# Altium project DB30.PRJPCB
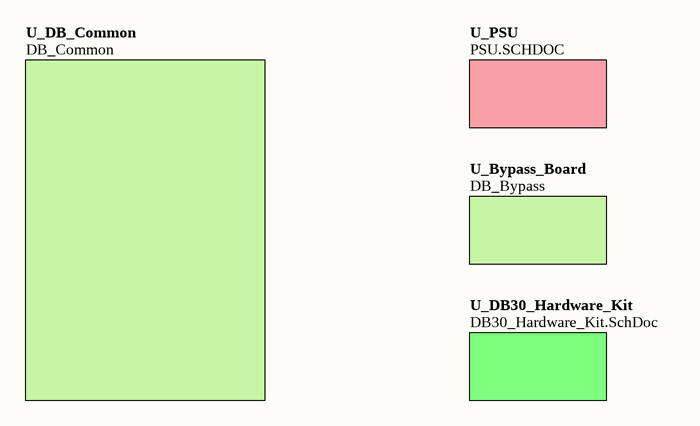
[diagram p0: DB30_Top.SchDoc]
ProjectAddress1: L3, 12A Rodborough Road; ProjectAddress2: Frenchs Forest; ProjectAddress3: NSW 2086; ProjectAddress4: Australia; ProjectAssyNum: D-820-0004; ProjectOrganization: Altium Limited; ProjectRevision: 07; ProjectTitle: DB30 - Daughter Board Spartan3; ProjectTotalSheets: 22
6 sheets, 49 parts. Net scope: hierarchical (ports join the sheet entries above them; power ports are global).
Board files: DB30_Panel.PcbDoc, DB30.PcbDoc
Sheets:
  DB30_Top.SchDoc
    U_PSU = PSU.SCHDOC
    U_DB30_Hardware_Kit = DB30_Hardware_Kit.SchDoc
  DEVICES.SchDoc
  Bypass_FPGA_1V2.SchDoc
  Bypass_FPGA_2V5.SchDoc

## Sheet DB30_Top.SchDoc: DB30 Top Level
size A4; Address1: Level 3, 12a Rodborough Rd; Address2: Frenchs Forest 2086; Address3: NSW; Address4: AUSTRALIA; SheetNumber: 2; SheetTotal: 23

### Sub-sheets
U_Bypass_Board = DB_Bypass (file not in this document): no entries
U_DB30_Hardware_Kit = DB30_Hardware_Kit.SchDoc: no entries
U_DB_Common = DB_Common (file not in this document): no entries
U_PSU = PSU.SCHDOC: no entries

### Notes on the sheet
- Sheet Title
- Project Title
- Size:
- Date:
- A4
- Assy:
- Time:
- Revision:
- Sheet
- of
- File:

## Sheet PSU.SCHDOC: Power Supply Top Level
size A4; Address1: Level 3, 12a Rodborough Rd; Address2: Frenchs Forest 2086; Address3: NSW; Address4: AUSTRALIA; SheetNumber: 10; SheetTotal: 23
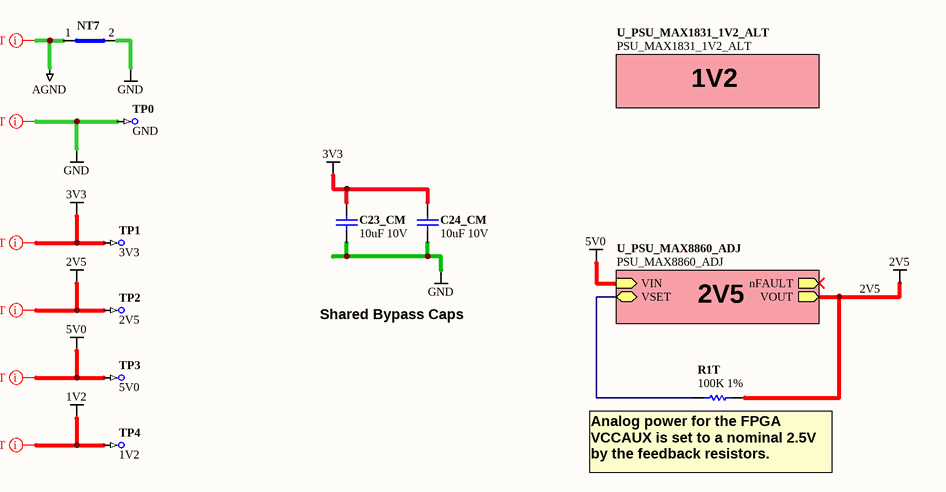
[diagram p1: PSU.SCHDOC]

### Parts
C23_CM  10uF 10V  [CAPC2012-STAR]
C24_CM  10uF 10V  [CAPC2012-STAR]
NT7  Net Tie SMT2  [NETTIE-SMT2-8X8]  (value not drawn)  (net tie, no BOM)
R1T  100K 1%  [RESC1005-STAR]
TP0  GND  [TestPin]  (no BOM)
TP1  3V3  [TestPin]  (no BOM)
TP2  2V5  [TestPin]  (no BOM)
TP3  5V0  [TestPin]  (no BOM)
TP4  1V2  [TestPin]  (no BOM)

### Sub-sheets
U_PSU_MAX1831_1V2_ALT = PSU_MAX1831_1V2_ALT (file not in this document): no entries
U_PSU_MAX8860_ADJ = PSU_MAX8860_ADJ (file not in this document): nFAULT (out), VIN (in), VOUT (out), VSET (bidir)

### Nets
1V2: TP4.1
2V5: R1T.2 TP2.1 ; sheet U_PSU_MAX8860_ADJ/VOUT
3V3: C23_CM.1 C24_CM.1 TP1.1
5V0: TP3.1 ; sheet U_PSU_MAX8860_ADJ/VIN
AGND: NT7.1(Net1)
GND: C23_CM.2 C24_CM.2 NT7.2(Net2) TP0.1
NetR1T_1: R1T.1 ; sheet U_PSU_MAX8860_ADJ/VSET

### Layout directives
net class PWRNET: 1V2, 2V5, 3V3, 5V0, AGND, GND

### Notes on the sheet
- 1V2
- Shared Bypass Caps
- 2V5
- (near R1T) Analog power for the FPGA VCCAUX is set to a nominal 2.5V by the feedback resistors.
- Sheet Title
- Project Title
- Size:
- Date:
- A4
- Assy:
- Time:
- Revision:
- Sheet
- of
- File:

### Library data of the parts
C23_CM C24_CM = D-101-0087: Capacitor, Ceramic, 10uF 10% 10V 0805 (2012) X5R; Polarity: Non-Polarized; Capacitance: 10 uF; Dielectric: X5R; Mounting Technology: Surface Mount; Rated Voltage: 10 V; Status: Unreleased; Technology: None; Tolerance: 10 %; Category: Capacitor
NT7 = D-002-0002: Net-Tie, Surface Mount, 2 x 0.4mm x 0.2mm SMT Pads - For 0.2mm Track; Status: Production; Category: Net-Tie
R1T = D-100-0132: Resistor, 100K 1% 0402 (1005); Power Rating: 63 mW; Mounting Technology: Surface Mount; Resistance: 100 K; Status: Production; Tolerance: 1 %; Category: Resistor
TP0-TP4 = D-006-0000: Test Point, PCB Mount with Silkscreen Box; Status: Production; Category: Test-Point

## Sheet DB30_Hardware_Kit.SchDoc: DB30 Hardware Kit
size A4; Address1: Level 3, 12a Rodborough Rd; Address2: Frenchs Forest 2086; Address3: NSW; Address4: AUSTRALIA; SheetNumber: 9; SheetTotal: 23
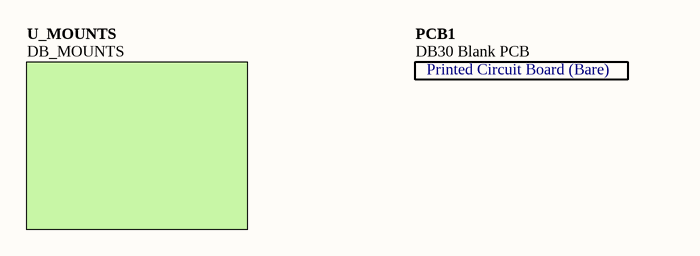
[diagram p2: DB30_Hardware_Kit.SchDoc]

### Parts
PCB1  DB30 Blank PCB  (mechanical)

### Sub-sheets
U_MOUNTS = DB_MOUNTS (file not in this document): no entries

### Notes on the sheet
- Sheet Title
- Project Title
- Size:
- Date:
- A4
- Assy:
- Time:
- Revision:
- Sheet
- of
- File:
- (in symbol D-810-0004) Printed Circuit Board (Bare)

### Library data of the parts
PCB1 = D-810-0004: DB30 Blank PCB - Daughter Board Xilinx Spartan3 XC3S1500-4FG676C; ProjectPath: DB30.PrjPCB; Status: Unreleased; Category: Blank PCB

## Sheet DEVICES.SchDoc: FPGA, LEDs and SRAM Memory
size A4; Address1: Level 3, 12a Rodborough Rd; Address2: Frenchs Forest 2086; Address3: NSW; Address4: AUSTRALIA; SheetNumber: 3; SheetTotal: 23
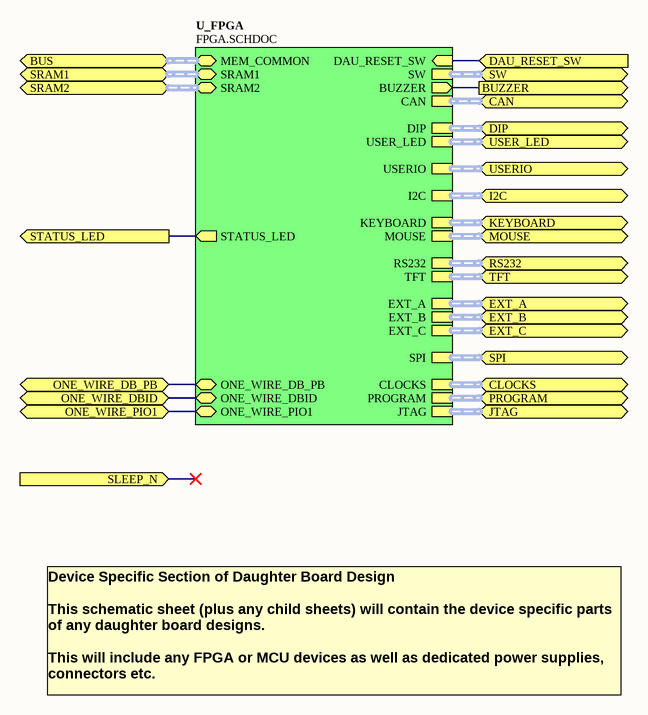
[diagram p3: DEVICES.SchDoc]

### Sub-sheets
U_FPGA = FPGA.SCHDOC (file not in this document): SRAM1 (harness SRAM-256Kx16), SRAM2 (harness SRAM-256Kx16), MEM_COMMON (harness HOSTMEMORY), DAU_RESET_SW (in), BUZZER (out), ONE_WIRE_DBID (bidir), ONE_WIRE_DB_PB (bidir), ONE_WIRE_PIO1 (bidir), JTAG (harness HardSoft_JTAG), SW (harness SW5), DIP (harness SW8), USERIO (harness IO36), EXT_A (harness PBIO), EXT_B (harness PBIO), EXT_C (harness PBIO), USER_LED (harness LED8), SPI (harness DAU_SPI), I2C (harness I2C), CAN (harness CAN_INT), RS232 (harness RS232_INT), KEYBOARD (harness PS2), MOUSE (harness PS2), TFT (harness DAU_TFT), PROGRAM (harness DAU_CTRL), CLOCKS (harness DAU_CLK), STATUS_LED (out)

### Ports
BUS (harness HOSTMEMORY), BUZZER (out), CAN, CLOCKS, DAU_RESET_SW (in), DIP, EXT_A, EXT_B, EXT_C, I2C, JTAG, KEYBOARD, MOUSE, ONE_WIRE_DB_PB (bidir), ONE_WIRE_DBID (bidir), ONE_WIRE_PIO1 (bidir), PROGRAM, RS232, SLEEP_N (in), SPI, SRAM1, SRAM2 (harness SRAM-256Kx16), STATUS_LED (out), SW, TFT, USER_LED, USERIO

### Nets
BUZZER: port BUZZER, sheet U_FPGA/BUZZER
DAU_RESET_SW: port DAU_RESET_SW, sheet U_FPGA/DAU_RESET_SW
ONE_WIRE_DB_PB: port ONE_WIRE_DB_PB, sheet U_FPGA/ONE_WIRE_DB_PB
ONE_WIRE_DBID: port ONE_WIRE_DBID, sheet U_FPGA/ONE_WIRE_DBID
ONE_WIRE_PIO1: port ONE_WIRE_PIO1, sheet U_FPGA/ONE_WIRE_PIO1
STATUS_LED: port STATUS_LED, sheet U_FPGA/STATUS_LED

### Buses and harness runs
harness port BUS = sheet U_FPGA/MEM_COMMON
harness port CAN = sheet U_FPGA/CAN
harness port CLOCKS = sheet U_FPGA/CLOCKS
harness port DIP = sheet U_FPGA/DIP
harness port EXT_A = sheet U_FPGA/EXT_A
harness port EXT_B = sheet U_FPGA/EXT_B
harness port EXT_C = sheet U_FPGA/EXT_C
harness port I2C = sheet U_FPGA/I2C
harness port JTAG = sheet U_FPGA/JTAG
harness port KEYBOARD = sheet U_FPGA/KEYBOARD
harness port MOUSE = sheet U_FPGA/MOUSE
harness port PROGRAM = sheet U_FPGA/PROGRAM
harness port RS232 = sheet U_FPGA/RS232
harness port SPI = sheet U_FPGA/SPI
harness port SRAM1 = sheet U_FPGA/SRAM1
harness port SRAM2 = sheet U_FPGA/SRAM2
harness port SW = sheet U_FPGA/SW
harness port TFT = sheet U_FPGA/TFT
harness port USER_LED = sheet U_FPGA/USER_LED
harness port USERIO = sheet U_FPGA/USERIO

### Notes on the sheet
- Device Specific Section of Daughter Board Design
  This schematic sheet (plus any child sheets) will contain the device specific parts of any daughter board designs.
  This will include any FPGA or MCU devices as well as dedicated power supplies, connectors etc.
- Sheet Title
- Project Title
- Size:
- Date:
- A4
- Assy:
- Time:
- Revision:
- Sheet
- of
- File:

## Sheet Bypass_FPGA_1V2.SchDoc: FPGA Bypass 1V2
size A4; Organization: Altium Limited.; Address1: Level 3, 12a Rodborough Rd; Address2: Frenchs Forest 2086; Address3: NSW; Address4: AUSTRALIA; SheetNumber: 5; SheetTotal: 23; PageSetup: Record=PageOptions|CenterHorizontal=True|CenterVertical=True|PrintScale=0.97|XCorrection=1.00|YCorrection=1.00|PrintKind=0|BorderSize=5000000|LeftOffset=0|BottomOffset=0|Orientation=2|PaperLength=1000|PaperWidth=1000|Scale=100|PaperSource=7|PrintQuality=-4|MediaType=1|DitherType=10|PaperKind=A4 (210 x 297 mm)|PrintScaleMode=1
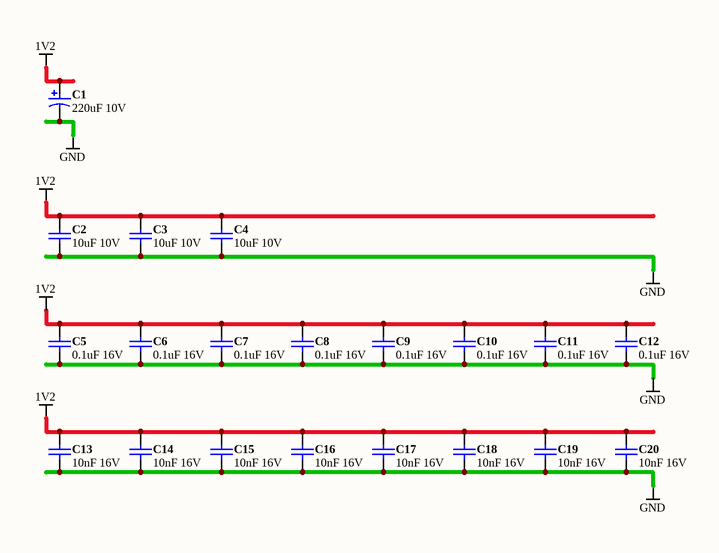
[diagram p4: Bypass_FPGA_1V2.SchDoc]

### Parts
(Parts that share a designator on the sheet are numbered #1, #2 ... from top to bottom, then left to right.)
C1#1  220uF 10V  [CAPC7343-STAR]
C2#1  10uF 10V  [CAPC2012-STAR]
C3#1  10uF 10V  [CAPC2012-STAR]
C4#1  10uF 10V  [CAPC2012-STAR]
C5#1  0.1uF 16V  [CAPC1005-STAR]
C6#1  0.1uF 16V  [CAPC1005-STAR]
C7#1  0.1uF 16V  [CAPC1005-STAR]
C8#1  0.1uF 16V  [CAPC1005-STAR]
C9#1  0.1uF 16V  [CAPC1005-STAR]
C10#1  0.1uF 16V  [CAPC1005-STAR]
C11#1  0.1uF 16V  [CAPC1005-STAR]
C12#1  0.1uF 16V  [CAPC1005-STAR]
C13#1  10nF 16V  [CAPC1005-STAR]
C14#1  10nF 16V  [CAPC1005-STAR]
C15#1  10nF 16V  [CAPC1005-STAR]
C16#1  10nF 16V  [CAPC1005-STAR]
C17#1  10nF 16V  [CAPC1005-STAR]
C18#1  10nF 16V  [CAPC1005-STAR]
C19#1  10nF 16V  [CAPC1005-STAR]
C20  10nF 16V  [CAPC1005-STAR]

### Nets
1V2: C1#1.1 C2#1.1 C3#1.1 C4#1.1 C5#1.1 C6#1.1 C7#1.1 C8#1.1 C9#1.1 C10#1.1 C11#1.1 C12#1.1 C13#1.1 C14#1.1 C15#1.1 C16#1.1 C17#1.1 C18#1.1 C19#1.1 C20.1
GND: C1#1.2 C2#1.2 C3#1.2 C4#1.2 C5#1.2 C6#1.2 C7#1.2 C8#1.2 C9#1.2 C10#1.2 C11#1.2 C12#1.2 C13#1.2 C14#1.2 C15#1.2 C16#1.2 C17#1.2 C18#1.2 C19#1.2 C20.2

### Notes on the sheet
- Sheet Title
- Project Title
- Size:
- Date:
- A4
- Assy:
- Time:
- Revision:
- Sheet
- of
- File:

### Library data of the parts
C1#1 = D-101-0088: Capacitor, Tantalum, 220uF 10% 10V MCCT-D (7343-31); Polarity: Polarized; Capacitance: 220 uF; Mounting Technology: Surface Mount; Rated Voltage: 10 V; Status: Unreleased; Technology: Tantalum; Tolerance: 10 %; Category: Capacitor
C2#1 C3#1 C4#1 = D-101-0087: as C23_CM on sheet PSU; Category: Capacitor; Capacitance: 10 uF; Dielectric: X5R; Mounting Technology: Surface Mount; Rated Voltage: 10 V; Status: Unreleased; Technology: None; Tolerance: 10 %
C5#1 C6#1 C7#1 C8#1 C9#1 C10#1 C11#1 C12#1 = D-101-0080: Capacitor, Ceramic, 0.1uF 10% 16V 0402 (1005) X7R; Polarity: Non-Polarized; Category: Capacitor; Capacitance: 0.1 uF; Dielectric: X7R; Mounting Technology: Surface Mount; Rated Voltage: 16 V; Status: Production; Technology: Ceramic; Tolerance: 10 %
C13#1 C14#1 C15#1 C16#1 C17#1 C18#1 C19#1 C20 = D-101-0077: Capacitor, Ceramic, 10nF 10% 16V 0402 (1005) X7R; Polarity: Non-Polarized; Category: Capacitor; Capacitance: 10 nF; Dielectric: X7R; Mounting Technology: Surface Mount; Rated Voltage: 16 V; Status: Production; Technology: Ceramic; Tolerance: 10 %

## Sheet Bypass_FPGA_2V5.SchDoc: FPGA Bypass 2V5
size A4; Organization: Altium Limited.; Address1: Level 3, 12a Rodborough Rd; Address2: Frenchs Forest 2086; Address3: NSW; Address4: AUSTRALIA; SheetNumber: 6; SheetTotal: 23; PageSetup: Record=PageOptions|CenterHorizontal=True|CenterVertical=True|PrintScale=0.97|XCorrection=1.00|YCorrection=1.00|PrintKind=0|BorderSize=5000000|LeftOffset=0|BottomOffset=0|Orientation=2|PaperLength=1000|PaperWidth=1000|Scale=100|PaperSource=7|PrintQuality=-4|MediaType=1|DitherType=10|PaperKind=A4 (210 x 297 mm)|PrintScaleMode=1
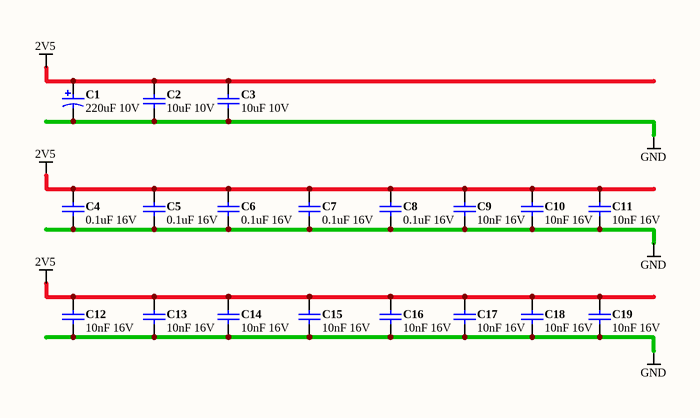
[diagram p5: Bypass_FPGA_2V5.SchDoc]

### Parts
(Parts that share a designator on the sheet are numbered #1, #2 ... from top to bottom, then left to right.)
C1#2  220uF 10V  [CAPC7343-STAR]
C2#2  10uF 10V  [CAPC2012-STAR]
C3#2  10uF 10V  [CAPC2012-STAR]
C4#2  0.1uF 16V  [CAPC1005-STAR]
C5#2  0.1uF 16V  [CAPC1005-STAR]
C6#2  0.1uF 16V  [CAPC1005-STAR]
C7#2  0.1uF 16V  [CAPC1005-STAR]
C8#2  0.1uF 16V  [CAPC1005-STAR]
C9#2  10nF 16V  [CAPC1005-STAR]
C10#2  10nF 16V  [CAPC1005-STAR]
C11#2  10nF 16V  [CAPC1005-STAR]
C12#2  10nF 16V  [CAPC1005-STAR]
C13#2  10nF 16V  [CAPC1005-STAR]
C14#2  10nF 16V  [CAPC1005-STAR]
C15#2  10nF 16V  [CAPC1005-STAR]
C16#2  10nF 16V  [CAPC1005-STAR]
C17#2  10nF 16V  [CAPC1005-STAR]
C18#2  10nF 16V  [CAPC1005-STAR]
C19#2  10nF 16V  [CAPC1005-STAR]

### Nets
2V5: C1#2.1 C2#2.1 C3#2.1 C4#2.1 C5#2.1 C6#2.1 C7#2.1 C8#2.1 C9#2.1 C10#2.1 C11#2.1 C12#2.1 C13#2.1 C14#2.1 C15#2.1 C16#2.1 C17#2.1 C18#2.1 C19#2.1
GND: C1#2.2 C2#2.2 C3#2.2 C4#2.2 C5#2.2 C6#2.2 C7#2.2 C8#2.2 C9#2.2 C10#2.2 C11#2.2 C12#2.2 C13#2.2 C14#2.2 C15#2.2 C16#2.2 C17#2.2 C18#2.2 C19#2.2

### Notes on the sheet
- Sheet Title
- Project Title
- Size:
- Date:
- A4
- Assy:
- Time:
- Revision:
- Sheet
- of
- File:

### Library data of the parts
C1#2 = D-101-0088: as C1#1 on sheet Bypass_FPGA_1V2; Capacitance: 220 uF; Mounting Technology: Surface Mount; Rated Voltage: 10 V; Status: Unreleased; Technology: Tantalum; Tolerance: 10 %; Category: Capacitor
C2#2 C3#2 = D-101-0087: as C23_CM on sheet PSU; Category: Capacitor; Capacitance: 10 uF; Dielectric: X5R; Mounting Technology: Surface Mount; Rated Voltage: 10 V; Status: Unreleased; Technology: None; Tolerance: 10 %
C4#2 C5#2 C6#2 C7#2 C8#2 = D-101-0080: as C5#1 on sheet Bypass_FPGA_1V2; Category: Capacitor; Capacitance: 0.1 uF; Dielectric: X7R; Mounting Technology: Surface Mount; Rated Voltage: 16 V; Status: Production; Technology: Ceramic; Tolerance: 10 %
C9#2 C10#2 C11#2 C12#2 C13#2 C14#2 C15#2 C16#2 C17#2 C18#2 C19#2 = D-101-0077: as C13#1 on sheet Bypass_FPGA_1V2; Category: Capacitor; Capacitance: 10 nF; Dielectric: X7R; Mounting Technology: Surface Mount; Rated Voltage: 16 V; Status: Production; Technology: Ceramic; Tolerance: 10 %

## Nets that join several sheets
1V2: PSU (TP4.1), Bypass_FPGA_1V2 (20 pins)
2V5: PSU (R1T.2 TP2.1), Bypass_FPGA_2V5 (19 pins)
GND: PSU (C23_CM.2 C24_CM.2 NT7.2 TP0.1), Bypass_FPGA_1V2 (20 pins), Bypass_FPGA_2V5 (19 pins)

## Assembly variants
Production: not fitted RN1 RN2 RN3 RN4 RN5 RN6 RN7 RN8 RN17 RN18 RN19 RN20 RN21 RN22 RN23 RN24 RN25 RN26 RN27 RN28 RN29 RN30 RN31 RN32